# EAGLE design GSElogger (EAGLE 9.6.2)
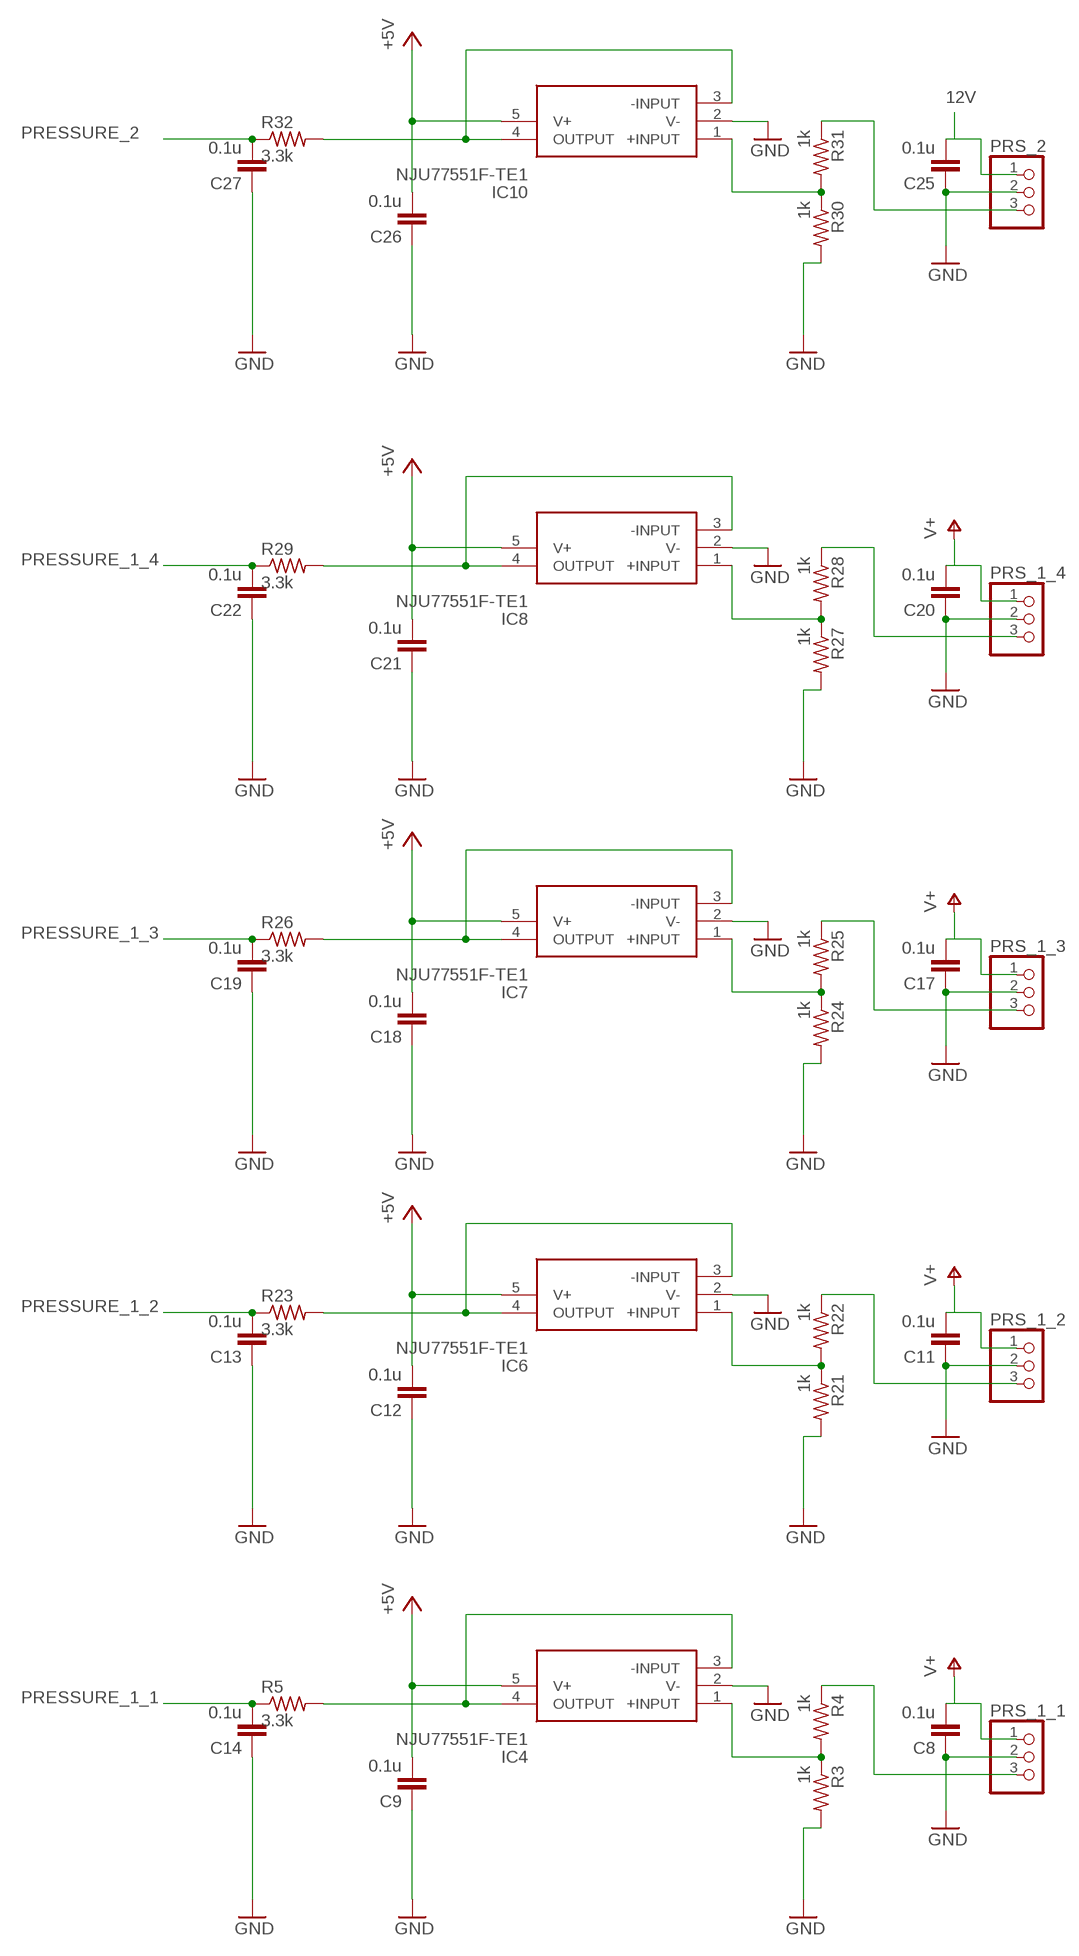
[diagram p0: schematic, sheet 1, part 1 of 3]
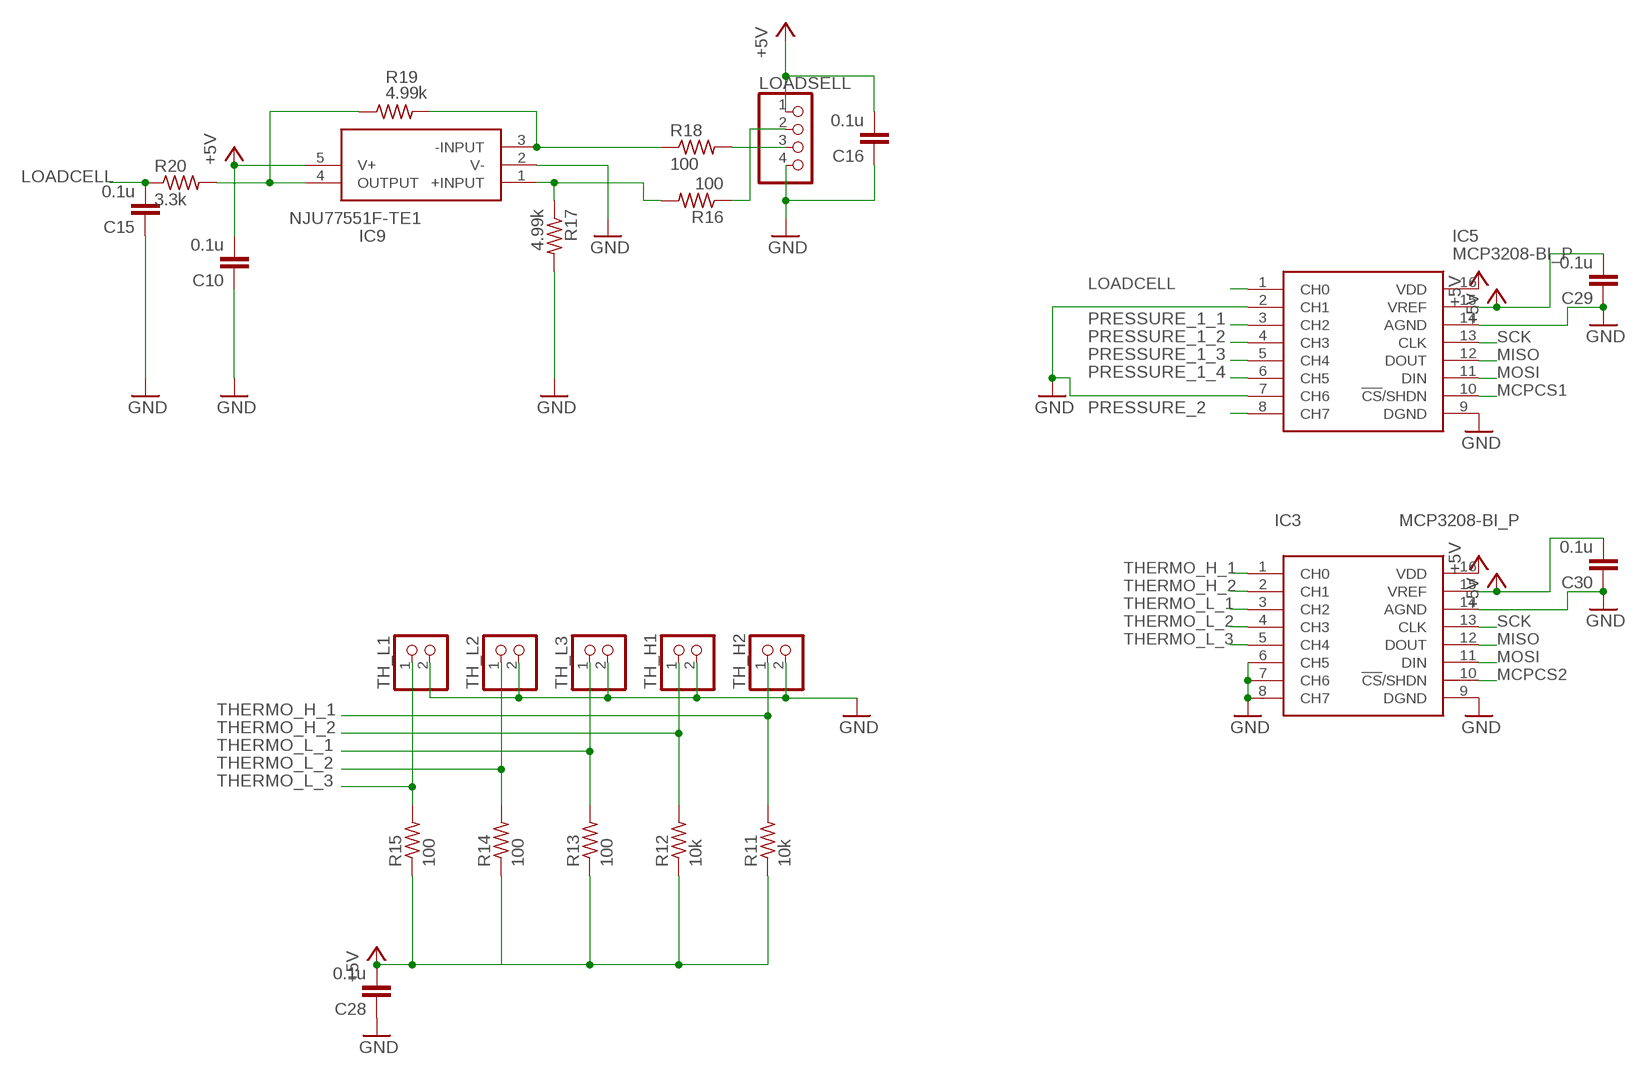
[diagram p1: schematic, sheet 1, part 2 of 3]
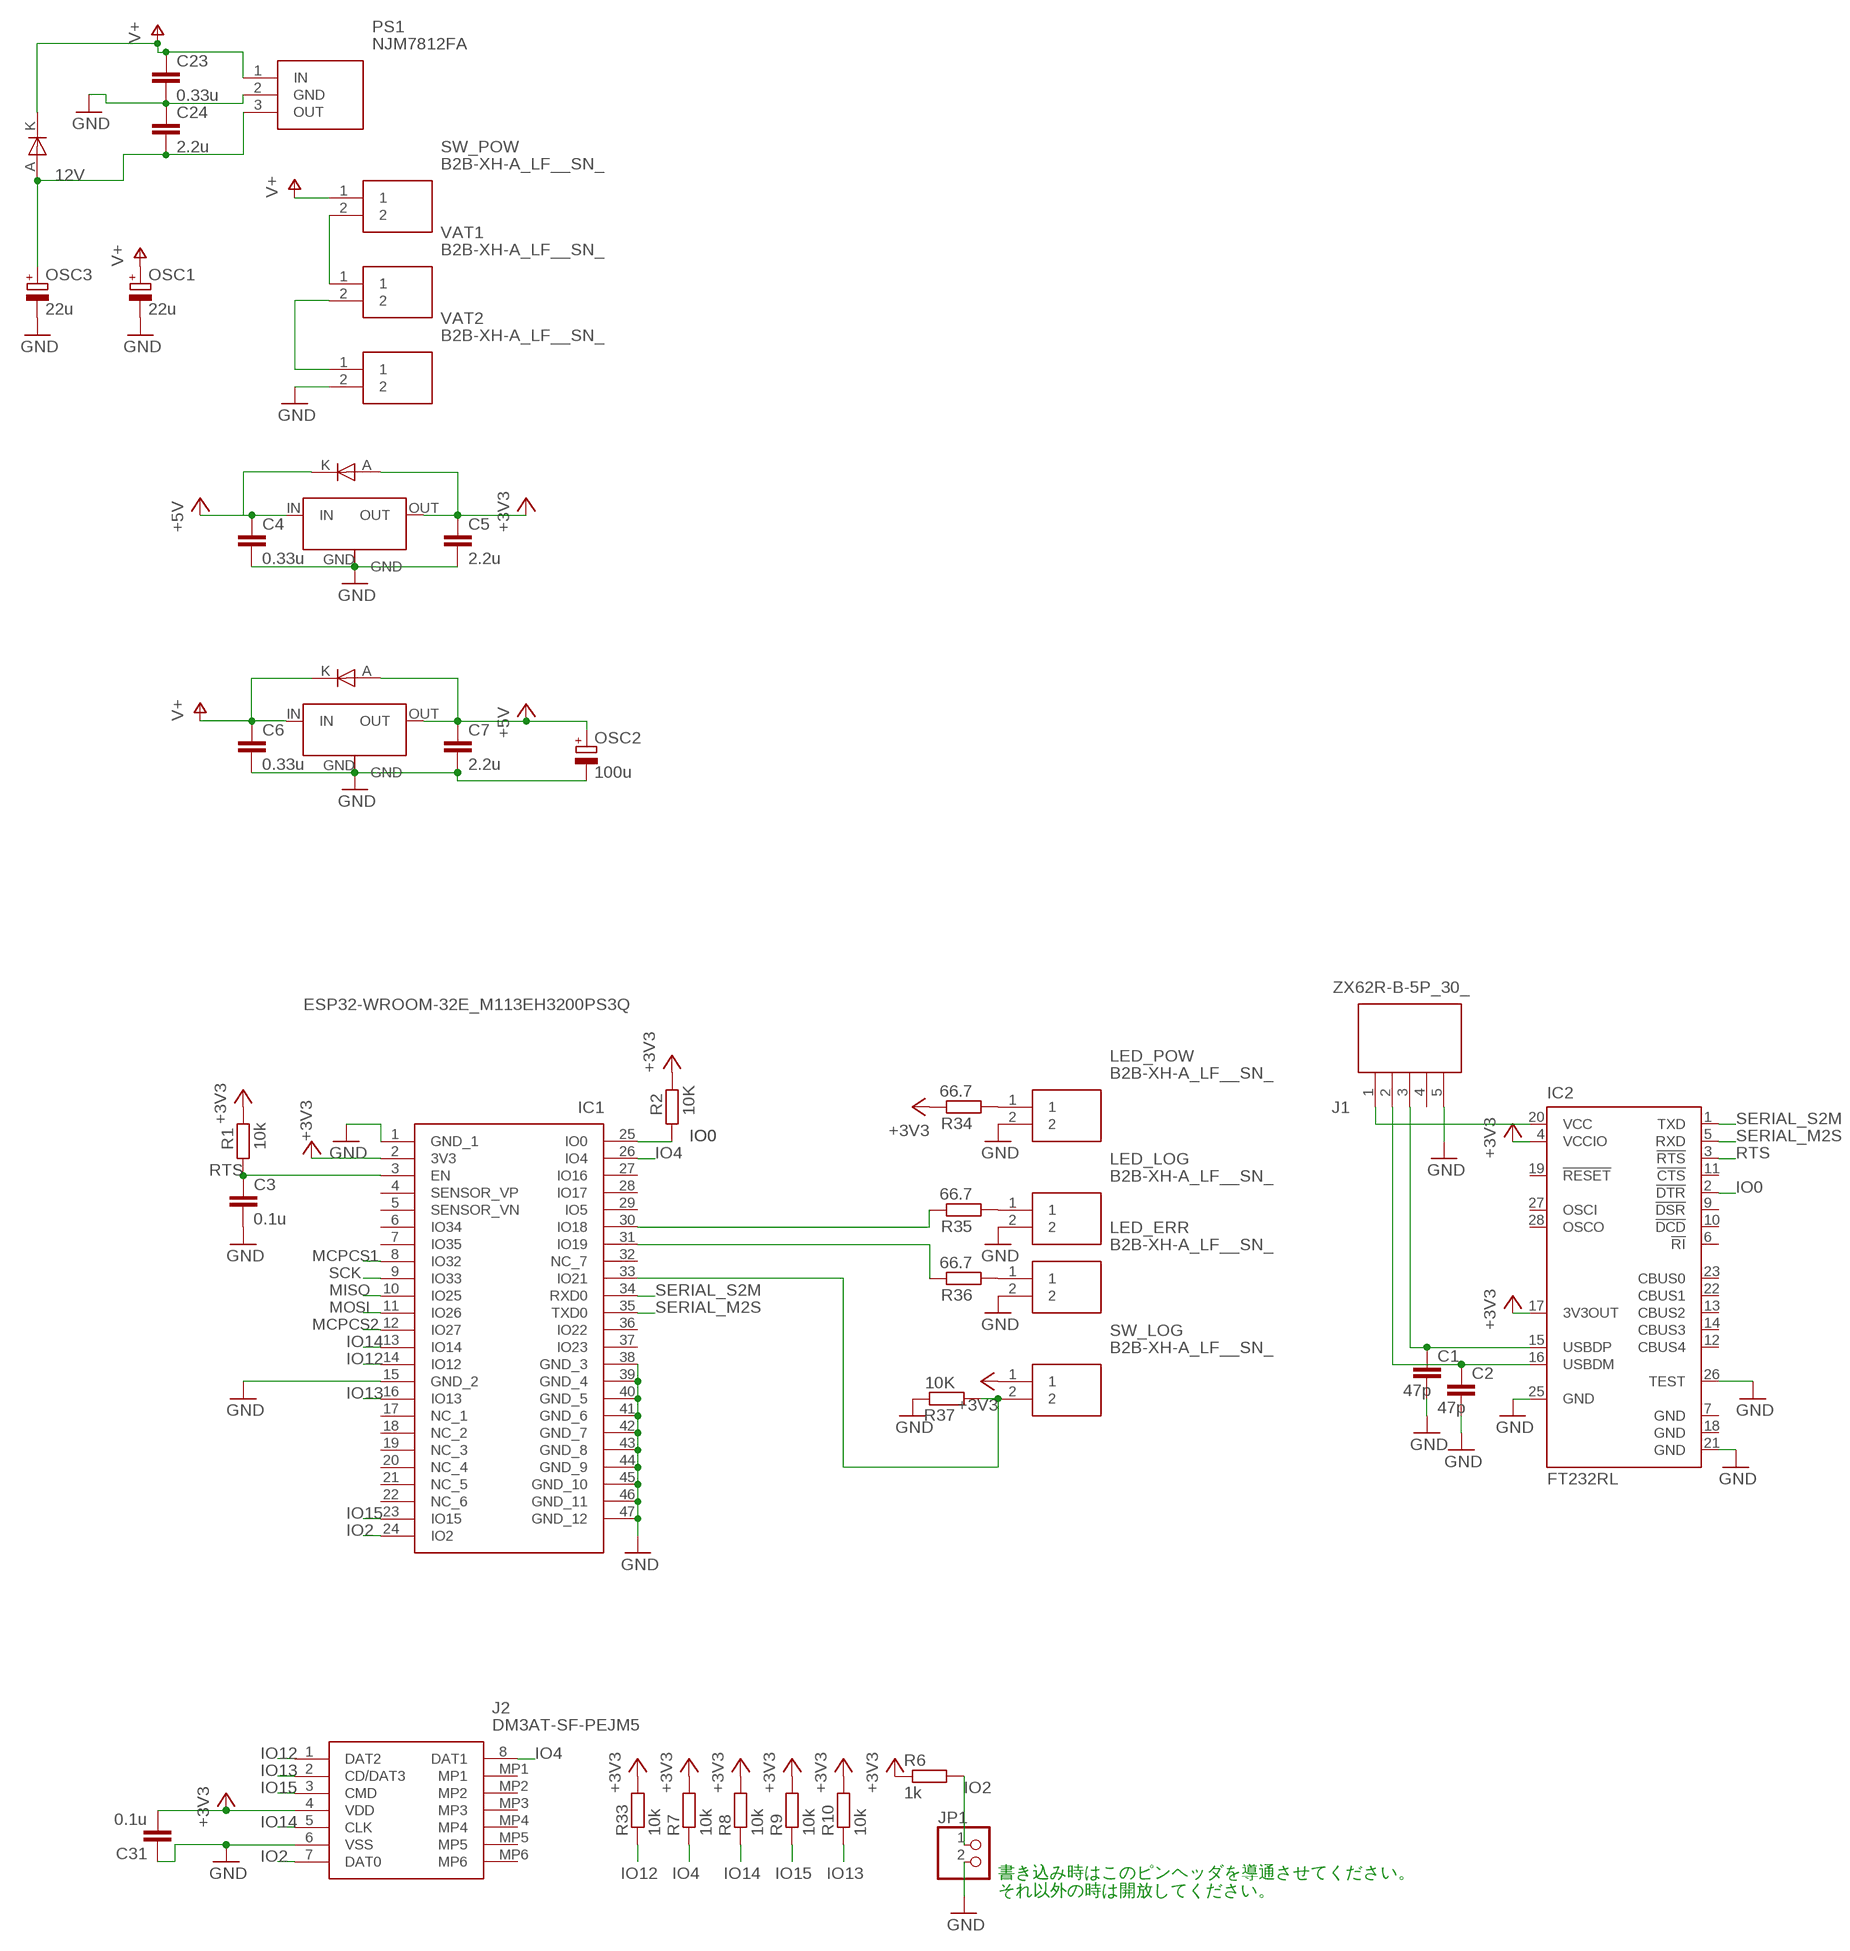
[diagram p2: schematic, sheet 1, part 3 of 3]

## Parts
C1  47p  C-EUC0603  [C0603]
C2  47p  C-EUC0603  [C0603]
C3  0.1u  C-EUC0603  [C0603]
C4  0.33u  C-EUC0603  [C0603]
C5  2.2u  C-EUC0603  [C0603]
C6  0.33u  C-EUC0603  [C0603]
C7  2.2u  C-EUC0603  [C0603]
C8  0.1u  C-EUC0603  [C0603]
C9  0.1u  C-EUC0603  [C0603]
C10  0.1u  C-EUC0603  [C0603]
C11  0.1u  C-EUC0603  [C0603]
C12  0.1u  C-EUC0603  [C0603]
C13  0.1u  C-EUC0603  [C0603]
C14  0.1u  C-EUC0603  [C0603]
C15  0.1u  C-EUC0603  [C0603]
C16  0.1u  C-EUC0603  [C0603]
C17  0.1u  C-EUC0603  [C0603]
C18  0.1u  C-EUC0603  [C0603]
C19  0.1u  C-EUC0603  [C0603]
C20  0.1u  C-EUC0603  [C0603]
C21  0.1u  C-EUC0603  [C0603]
C22  0.1u  C-EUC0603  [C0603]
C23  0.33u  C-EUC0603  [C0603]
C24  2.2u  C-EUC0603  [C0603]
C25  0.1u  C-EUC0603  [C0603]
C26  0.1u  C-EUC0603  [C0603]
C27  0.1u  C-EUC0603  [C0603]
C28  0.1u  C-EUC0603  [C0603]
C29  0.1u  C-EUC0603  [C0603]
C30  0.1u  C-EUC0603  [C0603]
C31  0.1u  C-EUC0603  [C0603]
IC1  ESP32-WROOM-32E_M113EH3200PS3Q  [ESP32WROOM32EM113EH3200PS3Q0]
IC2  FT232RL  [SSOP28]
IC3  MCP3208-BI_P  [DIP781W56P254L1918H533Q16N]
IC4  NJU77551F-TE1  [SOT95P280X130-5N]
IC5  MCP3208-BI_P  [DIP781W56P254L1918H533Q16N]
IC6  NJU77551F-TE1  [SOT95P280X130-5N]
IC7  NJU77551F-TE1  [SOT95P280X130-5N]
IC8  NJU77551F-TE1  [SOT95P280X130-5N]
IC9  NJU77551F-TE1  [SOT95P280X130-5N]
IC10  NJU77551F-TE1  [SOT95P280X130-5N]
J1  ZX62R-B-5P_30_  [ZX62R-B-5P(30)]
J2  DM3AT-SF-PEJM5  [DM3ATSFPEJM5]
JP1  PINHD-1X2  [1X02]
LED_ERR  B2B-XH-A_LF__SN_  [SHDR2W64P0X250_1X2_740X575X700]
LED_LOG  B2B-XH-A_LF__SN_  [SHDR2W64P0X250_1X2_740X575X700]
LED_POW  B2B-XH-A_LF__SN_  [SHDR2W64P0X250_1X2_740X575X700]
LOADSELL  PINHD-1X4  [1X04]
NJM7805S  5v reg  NJM2391DL1-33  [NJM2391DL1-33]
OSC1  22u  CPOL-EUE2,5-6E  [E2,5-6E]
OSC2  100u  CPOL-EUE2,5-6E  [E2,5-6E]
OSC3  22u  CPOL-EUE2,5-6E  [E2,5-6E]
PRS_1_1  PINHD-1X3  [1X03]
PRS_1_2  PINHD-1X3  [1X03]
PRS_1_3  PINHD-1X3  [1X03]
PRS_1_4  PINHD-1X3  [1X03]
PRS_2  PINHD-1X3  [1X03]
PS1  NJM7812FA  [TO254P500X1000X2170-3P]
R1  10k  R-EU_R0603  [R0603]
R2  10K  R-EU_R0603  [R0603]
R3  1k  R-US_R0603  [R0603]
R4  1k  R-US_R0603  [R0603]
R5  3.3k  R-US_R0603  [R0603]
R6  1k  R-EU_R0603  [R0603]
R7  10k  R-EU_R0603  [R0603]
R8  10k  R-EU_R0603  [R0603]
R9  10k  R-EU_R0603  [R0603]
R10  10k  R-EU_R0603  [R0603]
R11  10k  R-US_R0603  [R0603]
R12  10k  R-US_R0603  [R0603]
R13  100  R-US_R0603  [R0603]
R14  100  R-US_R0603  [R0603]
R15  100  R-US_R0603  [R0603]
R16  100  R-US_R0603  [R0603]
R17  4.99k  R-US_R0603  [R0603]
R18  100  R-US_R0603  [R0603]
R19  4.99k  R-US_R0603  [R0603]
R20  3.3k  R-US_R0603  [R0603]
R21  1k  R-US_R0603  [R0603]
R22  1k  R-US_R0603  [R0603]
R23  3.3k  R-US_R0603  [R0603]
R24  1k  R-US_R0603  [R0603]
R25  1k  R-US_R0603  [R0603]
R26  3.3k  R-US_R0603  [R0603]
R27  1k  R-US_R0603  [R0603]
R28  1k  R-US_R0603  [R0603]
R29  3.3k  R-US_R0603  [R0603]
R30  1k  R-US_R0603  [R0603]
R31  1k  R-US_R0603  [R0603]
R32  3.3k  R-US_R0603  [R0603]
R33  10k  R-EU_R0603  [R0603]
R34  66.7  R-EU_R0603  [R0603]
R35  66.7  R-EU_R0603  [R0603]
R36  66.7  R-EU_R0603  [R0603]
R37  10K  R-EU_R0603  [R0603]
SW_LOG  B2B-XH-A_LF__SN_  [SHDR2W64P0X250_1X2_740X575X700]
SW_POW  B2B-XH-A_LF__SN_  [SHDR2W64P0X250_1X2_740X575X700]
TH_H1  PINHD-1X2  [1X02]
TH_H2  PINHD-1X2  [1X02]
TH_L1  PINHD-1X2  [1X02]
TH_L2  PINHD-1X2  [1X02]
TH_L3  PINHD-1X2  [1X02]
U$1  SS2040FL  [SS2040FL]
U$2  3v3 reg  NJM2391DL1-33  [NJM2391DL1-33]
U$3  SS2040FL  [SS2040FL]
U$4  SS2040FL  [SS2040FL]
VAT1  B2B-XH-A_LF__SN_  [SHDR2W64P0X250_1X2_740X575X700]
VAT2  B2B-XH-A_LF__SN_  [SHDR2W64P0X250_1X2_740X575X700]

## Nets
12V: C24.2 C25.2 OSC3.+ PRS_2.1 PS1.3(OUT) U$4.A
+3V3: C5.1 C31.2 IC1.2(3V3) IC2.4(VCCIO) IC2.17(3V3OUT) J2.4(VDD) R1.2 R2.2 R6.1 R7.2 R8.2 R9.2 R10.2 R33.2 R34.2 SW_LOG.1 U$1.A U$2.OUT
+5V: C4.1 C7.1 C9.2 C10.2 C12.2 C16.2 C18.2 C21.2 C26.2 C28.2 C29.2 C30.2 IC3.15(VREF) IC3.16(VDD) IC4.5(V+) IC5.15(VREF) IC5.16(VDD) IC6.5(V+) IC7.5(V+) IC8.5(V+) IC9.5(V+) IC10.5(V+) LOADSELL.1 NJM7805S.OUT OSC2.+ R11.1 R12.1 R13.1 R14.1 R15.1 U$1.K U$2.IN U$3.A
GND: C1.2 C2.2 C3.2 C4.2 C5.2 C6.2 C7.2 C8.1 C9.1 C10.1 C11.1 C12.1 C13.1 C14.1 C15.1 C16.1 C17.1 C18.1 C19.1 C20.1 C21.1 C22.1 C23.2 C24.1 C25.1 C26.1 C27.1 C28.1 C29.1 C30.1 C31.1 IC1.1(GND_1) IC1.15(GND_2) IC1.38(GND_3) IC1.39(GND_4) IC1.40(GND_5) IC1.41(GND_6) IC1.42(GND_7) IC1.43(GND_8) IC1.44(GND_9) IC1.45(GND_10) IC1.46(GND_11) IC1.47(GND_12) IC2.21(GND) IC2.25(GND) IC2.26(TEST) IC3.6(CH5) IC3.7(CH6) IC3.8(CH7) IC3.9(DGND) IC3.14(AGND) IC4.2(V-) IC5.2(CH1) IC5.7(CH6) IC5.9(DGND) IC5.14(AGND) IC6.2(V-) IC7.2(V-) IC8.2(V-) IC9.2(V-) IC10.2(V-) J1.5 J2.6(VSS) JP1.2 LED_ERR.2 LED_LOG.2 LED_POW.2 LOADSELL.4 NJM7805S.GND OSC1.- OSC2.- OSC3.- PRS_1_1.2 PRS_1_2.2 PRS_1_3.2 PRS_1_4.2 PRS_2.2 PS1.2(GND) R3.2 R17.2 R21.2 R24.2 R27.2 R30.2 R37.2 TH_H1.2 TH_H2.2 TH_L1.2 TH_L2.2 TH_L3.2 U$2.GND VAT2.2
IO0: IC1.25(IO0) IC2.2(!DTR) R2.1
IO2: IC1.24(IO2) J2.7(DAT0) JP1.1 R6.2
IO4: IC1.26(IO4) J2.8(DAT1) R7.1
IO12: IC1.14(IO12) J2.1(DAT2) R33.1
IO13: IC1.16(IO13) J2.2(CD/DAT3) R10.1
IO14: IC1.13(IO14) J2.5(CLK) R8.1
IO15: IC1.23(IO15) J2.3(CMD) R9.1
LOADCELL: C15.2 IC5.1(CH0) R20.1
MCPCS1: IC1.8(IO32) IC5.10(!CS!/SHDN)
MCPCS2: IC1.12(IO27) IC3.10(!CS!/SHDN)
MISO: IC1.10(IO25) IC3.12(DOUT) IC5.12(DOUT)
MOSI: IC1.11(IO26) IC3.11(DIN) IC5.11(DIN)
N$1: IC4.3(-INPUT) IC4.4(OUTPUT) R5.2
N$2: IC2.20(VCC) J1.1
N$3: C2.1 IC2.16(USBDM) J1.2
N$4: C1.1 IC2.15(USBDP) J1.3
N$5: IC4.1(+INPUT) R3.1 R4.2
N$6: IC6.1(+INPUT) R21.1 R22.2
N$7: PRS_1_1.3 R4.1
N$8: PRS_1_2.3 R22.1
N$9: IC6.3(-INPUT) IC6.4(OUTPUT) R23.2
N$10: IC7.1(+INPUT) R24.1 R25.2
N$11: PRS_1_3.3 R25.1
N$12: IC7.3(-INPUT) IC7.4(OUTPUT) R26.2
N$13: IC8.1(+INPUT) R27.1 R28.2
N$14: PRS_1_4.3 R28.1
N$15: IC8.3(-INPUT) IC8.4(OUTPUT) R29.2
N$16: IC9.4(OUTPUT) R19.1 R20.2
N$17: VAT1.2 VAT2.1
N$18: IC10.1(+INPUT) R30.1 R31.2
N$19: PRS_2.3 R31.1
N$20: IC10.3(-INPUT) IC10.4(OUTPUT) R32.2
N$21: SW_POW.2 VAT1.1
N$22: LOADSELL.2 R16.1
N$23: LED_POW.1 R34.1
N$24: IC9.3(-INPUT) R18.1 R19.2
N$25: LOADSELL.3 R18.2
N$26: LED_LOG.1 R35.1
N$27: LED_ERR.1 R36.1
N$28: IC9.1(+INPUT) R16.2 R17.1
N$29: IC1.30(IO18) R35.2
N$30: IC1.31(IO19) R36.2
N$31: IC1.33(IO21) R37.1 SW_LOG.2
PRESSURE_1_1: C14.2 IC5.3(CH2) R5.1
PRESSURE_1_2: C13.2 IC5.4(CH3) R23.1
PRESSURE_1_3: C19.2 IC5.5(CH4) R26.1
PRESSURE_1_4: C22.2 IC5.6(CH5) R29.1
PRESSURE_2: C27.2 IC5.8(CH7) R32.1
RTS: C3.1 IC1.3(EN) IC2.3(!RTS) R1.1
SCK: IC1.9(IO33) IC3.13(CLK) IC5.13(CLK)
SERIAL_M2S: IC1.35(TXD0) IC2.5(RXD)
SERIAL_S2M: IC1.34(RXD0) IC2.1(TXD)
THERMO_H_1: IC3.1(CH0) R11.2 TH_H2.1
THERMO_H_2: IC3.2(CH1) R12.2 TH_H1.1
THERMO_L_1: IC3.3(CH2) R13.2 TH_L3.1
THERMO_L_2: IC3.4(CH3) R14.2 TH_L2.1
THERMO_L_3: IC3.5(CH4) R15.2 TH_L1.1
V+: C6.1 C8.2 C11.2 C17.2 C20.2 C23.1 NJM7805S.IN OSC1.+ PRS_1_1.1 PRS_1_2.1 PRS_1_3.1 PRS_1_4.1 PS1.1(IN) SW_POW.1 U$3.K U$4.K
Unconnected: IC1.4(SENSOR_VP) IC1.5(SENSOR_VN) IC1.6(IO34) IC1.7(IO35) IC1.17(NC_1) IC1.18(NC_2) IC1.19(NC_3) IC1.20(NC_4) IC1.21(NC_5) IC1.22(NC_6) IC1.27(IO16) IC1.28(IO17) IC1.29(IO5) IC1.32(NC_7) IC1.36(IO22) IC1.37(IO23) IC2.6(!RI) IC2.9(!DSR) IC2.10(!DCD) IC2.11(!CTS) IC2.12(CBUS4) IC2.13(CBUS2) IC2.14(CBUS3) IC2.19(!RESET) IC2.22(CBUS1) IC2.23(CBUS0) IC2.27(OSCI) IC2.28(OSCO) J1.4 J2.MP1 J2.MP2 J2.MP3 J2.MP4 J2.MP5 J2.MP6

## Notes on the sheet
- 書き込み時はこのピンヘッダを導通させてください。
  それ以外の時は開放してください。

## Power pins joined to a net without a drawn wire
GND: IC2.7(GND) IC2.18(GND)

## Library data of the parts
C1-C31 = rcl:C-EU: CAPACITOR, European symbol; SPICEPREFIX: C
IC1 = SamacSys_Parts:ESP32-WROOM-32E_M113EH3200PS3Q: WiFi Modules (802.11) SMD module, ESP32-D0WD-V3, ESP32 ECO V3, 4 MB SPI flash, PCB antenna, -40 C ~ +105 C. Source: Datasheet <https://www.espressif.com/sites/default/files/documentation/esp32-wroom-32e_esp32-wroom-32ue_datasheet_en.pdf>; DESCRIPTION: WiFi Modules (802.11) SMD module, ESP32-D0WD-V3, ESP32 ECO V3, 4 MB SPI flash, PCB antenna, -40 C ~ +105 C.; HEIGHT: 3.25mm; MANUFACTURER_NAME: Espressif Systems; MANUFACTURER_PART_NUMBER: ESP32-WROOM-32E(M113EH3200PS3Q0); MOUSER_PART_NUMBER: 356-ESP32WRM320EH3PS; MOUSER_PRICE-STOCK: https://www.mouser.co.uk/ProductDetail/Espressif-Systems/ESP32-WROOM-32EM113EH3200PS3Q0?qs=sPbYRqrBIVkiZhzSFda8%2FA%3D%3D
IC2 = ftdichip:FT232R: Source: http://www.ftdichip.com/Documents/DataSheets/DS_FT232R_v104.pdf; MPN: FT232RL; OC_FARNELL: 1146032; OC_NEWARK: 91K9918
IC3 IC5 = SamacSys_Parts:MCP3208-BI_P: 12 bit ADC Differential, Serial, 16-Pin PDIP Source: Datasheet <https://datasheet.datasheetarchive.com/originals/distributors/Datasheets-DGA17/1031129.pdf>; ARROW_PART_NUMBER: MCP3208-BI/P; ARROW_PRICE-STOCK: https://www.arrow.com/en/products/mcp3208-bip/microchip-technology?region=nac; DESCRIPTION: 12 bit ADC Differential, Serial, 16-Pin PDIP; HEIGHT: 5.334mm; MANUFACTURER_NAME: Microchip; MANUFACTURER_PART_NUMBER: MCP3208-BI/P; MOUSER_PART_NUMBER: 579-MCP3208-BI/P; MOUSER_PRICE-STOCK: https://www.mouser.co.uk/ProductDetail/Microchip-Technology/MCP3208-BI-P?qs=iwvYsH9bSFbUibDxw9o3cw%3D%3D
IC4 IC6-IC10 = SamacSys_Parts:NJU77551F-TE1: IC OPAMP GP 1 CIRCUIT SOT23-5 Source: Datasheet <https://www.mouser.in/datasheet/2/294/NJU77550_NJU77551_NJU77552_NJU77554_E-1371145.pdf>; DESCRIPTION: IC OPAMP GP 1 CIRCUIT SOT23-5; HEIGHT: 1.3mm; MANUFACTURER_NAME: New Japan Radio; MANUFACTURER_PART_NUMBER: NJU77551F-TE1; MOUSER_PART_NUMBER: 513-NJU77551F-TE1; MOUSER_PRICE-STOCK: https://www.mouser.co.uk/ProductDetail/NJR/NJU77551F-TE1?qs=%252B6g0mu59x7K%2FR%252BJlv4Vu3w%3D%3D
J1 = SamacSys_Parts:ZX62R-B-5P_30_: Hirose ZX, Straight SMT, Type B Version 2.0 Micro USB Connector Receptacle Source: Datasheet <http://www.farnell.com/datasheets/2360818.pdf>; ARROW_PART_NUMBER: ZX62R-B-5P(30); ARROW_PRICE-STOCK: https://www.arrow.com/en/products/zx62r-b-5p-30/hirose-electric; DESCRIPTION: Hirose ZX, Straight SMT, Type B Version 2.0 Micro USB Connector Receptacle; HEIGHT: mm; MANUFACTURER_NAME: Hirose; MANUFACTURER_PART_NUMBER: ZX62R-B-5P(30); MOUSER_PART_NUMBER: 798-ZX62R-B-5P30; MOUSER_PRICE-STOCK: https://www.mouser.co.uk/ProductDetail/Hirose-Connector/ZX62R-B-5P30?qs=4J5DPWWS9EAThzyZtJ4A7A%3D%3D
J2 = SamacSys_Parts:DM3AT-SF-PEJM5: Memory Card Connectors R/A SMT MICROSD CON PUSH-PUSH TOP BRDMNT Source: Datasheet <https://datasheet.lcsc.com/szlcsc/Hirose-HRS-DM3AT-SF-PEJM5_C114218.pdf>; DESCRIPTION: Memory Card Connectors R/A SMT MICROSD CON PUSH-PUSH TOP BRDMNT; HEIGHT: 1.83mm; MANUFACTURER_NAME: Hirose; MANUFACTURER_PART_NUMBER: DM3AT-SF-PEJM5; MOUSER_PART_NUMBER: 798-DM3AT-SF-PEJM5; MOUSER_PRICE-STOCK: https://www.mouser.co.uk/ProductDetail/Hirose-Connector/DM3AT-SF-PEJM5?qs=LZSZKJVF%252B2WTDKp%252BR7IYAQ%3D%3D
JP1 TH_H1 TH_H2 TH_L1-TH_L3 = pinhead:PINHD-1X2: PIN HEADER
LED_ERR LED_LOG LED_POW SW_LOG SW_POW VAT1 VAT2 = SamacSys_Parts:B2B-XH-A_LF__SN_: Connector Header Through Hole 2 position 0.098" (2.50mm) Source: Datasheet <http://www.jst-mfg.com/product/pdf/eng/eXH.pdf>; ARROW_PART_NUMBER: B2B-XH-A(LF)(SN); ARROW_PRICE-STOCK: https://www.arrow.com/en/products/b2b-xh-a-lf-sn/jst-manufacturing?region=europe; DESCRIPTION: Connector Header Through Hole 2 position 0.098" (2.50mm); HEIGHT: 7mm; MANUFACTURER_NAME: JST (JAPAN SOLDERLESS TERMINALS); MANUFACTURER_PART_NUMBER: B2B-XH-A(LF)(SN)
LOADSELL = pinhead:PINHD-1X4: PIN HEADER
NJM7805S U$2 = CREATE_sensor_dip:NJM2391DL1-33
OSC1-OSC3 = rcl:CPOL-EU: POLARIZED CAPACITOR, European symbol; SPICEPREFIX: C
PRS_1_1-PRS_1_4 PRS_2 = pinhead:PINHD-1X3: PIN HEADER
PS1 = SamacSys_Parts:NJM7812FA: Linear Voltage Regulators 12V 1.5A 3 Terminal Source: Datasheet <https://componentsearchengine.com/Datasheets/1/NJM7812FA.pdf>; DESCRIPTION: Linear Voltage Regulators 12V 1.5A 3 Terminal; HEIGHT: 5mm; MANUFACTURER_NAME: New Japan Radio; MANUFACTURER_PART_NUMBER: NJM7812FA; MOUSER_PART_NUMBER: 513-NJM7812FA; MOUSER_PRICE-STOCK: https://www.mouser.co.uk/ProductDetail/NJR/NJM7812FA?qs=zkD0Fgr6F%252BmtJvTrEE%2FNvg%3D%3D
R1 R2 R6-R10 R33-R37 = rcl:R-EU_: RESISTOR, European symbol; SPICEPREFIX: R
R3-R5 R11-R32 = rcl:R-US_: RESISTOR, American symbol; SPICEPREFIX: R
U$1 U$3 U$4 = CREATE_sensor_dip:SS2040FL

## Board
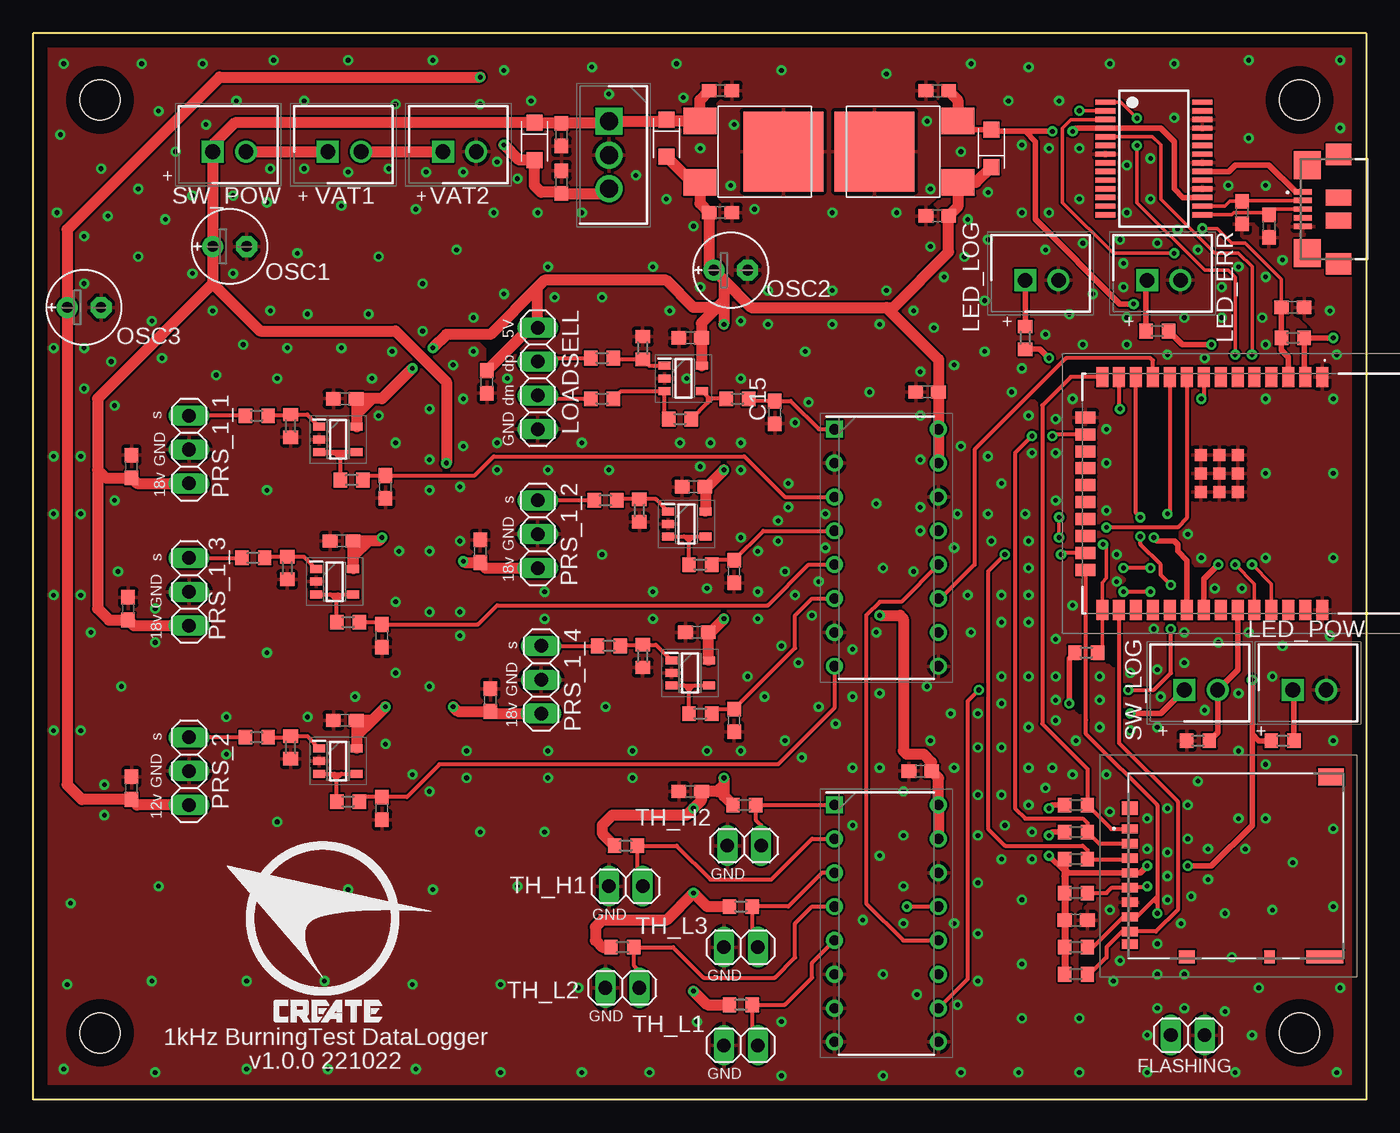
[diagram p3: board, top side]
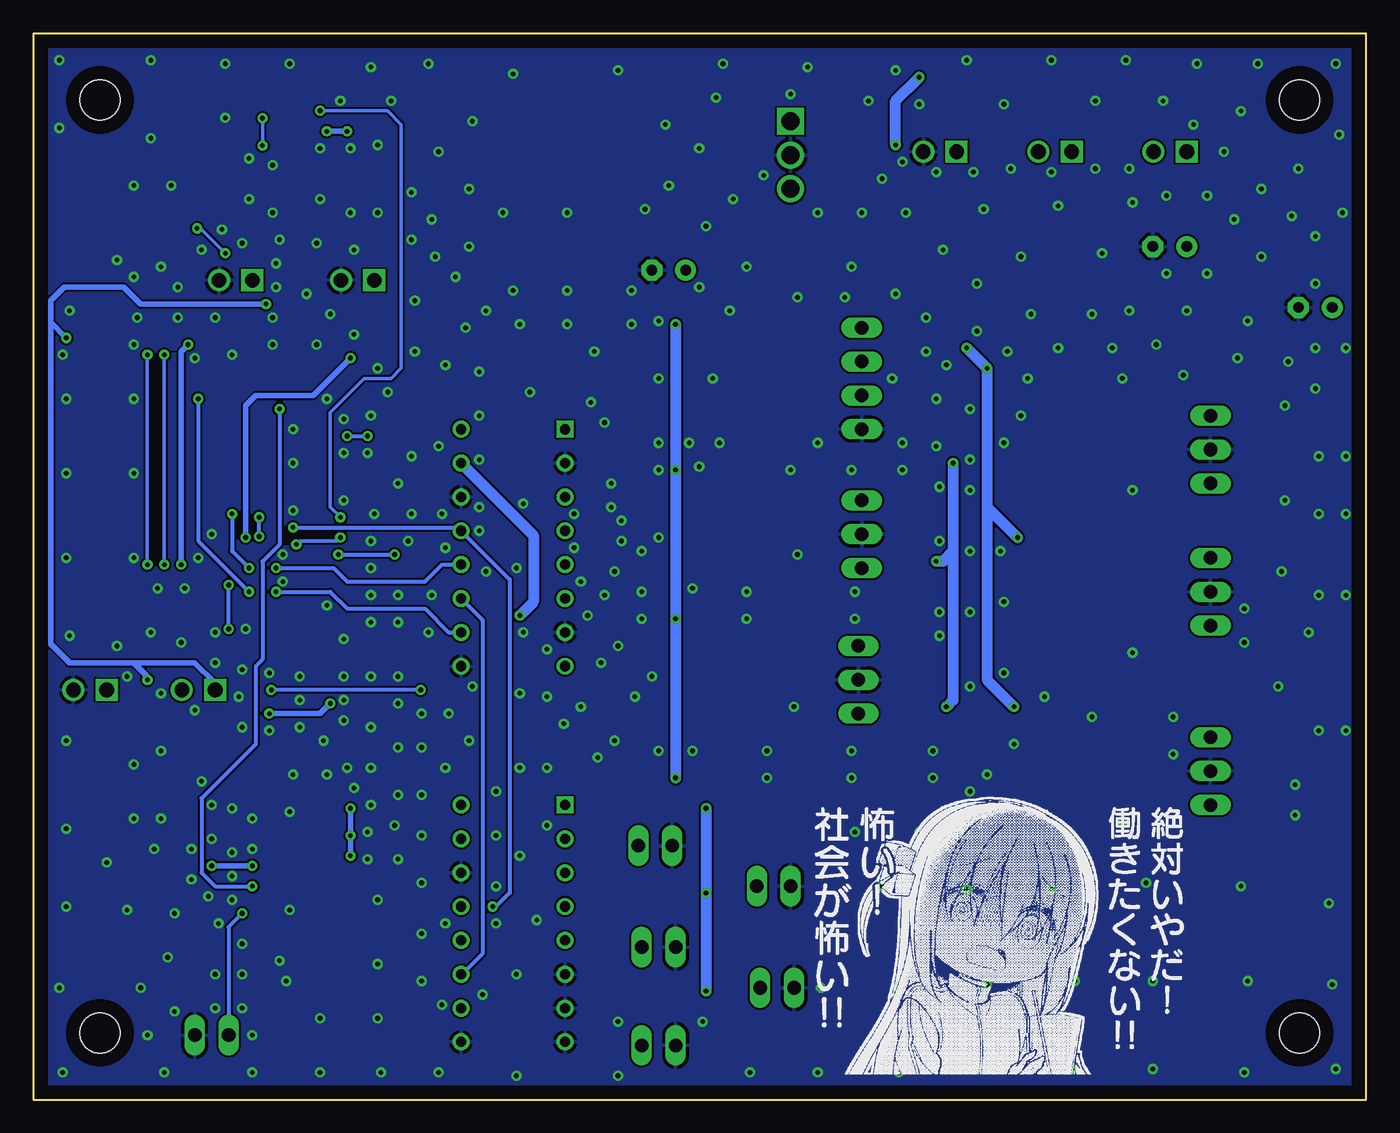
[diagram p4: board, bottom side, seen from below]

Size 100 x 80 mm. Coordinates in mm from the lower left corner, seen from the top.
Outline: 0,0 0,80 100,80 100,0 0,0
Copper layers (1*16): Top 0.035mm / dielectric 1.5mm / Bottom 0.035mm
Design rules "default": minimum track width 6mil, minimum drill 0.35mm, track to track 6mil, track to pad 6mil, pad to pad 6mil, via to via 6mil, smd to smd 6mil, copper to edge 40mil, drill to drill 6mil, minimum pad ring 10mil, minimum via ring 8mil, stop-mask expansion 4mil, vias tented up to drill 0mil, thermal gap 10mil
Holes 3 mm at 5,5 95,5 95,75 5,75
tRestrict: 31 lines
bRestrict: 3 lines

### Footprints (pad centres in the part's own frame; a part is rotated, then mirrored left to right if it is on the bottom)
C0603 = smd 1.1 x 1: 1 -0.85,0; 2 0.85,0
ESP32WROOM32EM113EH3200PS3Q0 = smd 1.5 x 0.9: 1 -8.75,5.26; 2 -8.75,3.99; 3 -8.75,2.72; 4 -8.75,1.45; 5 -8.75,0.18; 6 -8.75,-1.09; 7 -8.75,-2.36; 8 -8.75,-3.63; 9 -8.75,-4.9; 10 -8.75,-6.17; 11 -8.75,-7.44; 12 -8.75,-8.71; 13 -8.75,-9.98; 14 -8.75,-11.25; 25 8.75,-11.25; 26 8.75,-9.98; 27 8.75,-8.71; 28 8.75,-7.44; 29 8.75,-6.17; 30 8.75,-4.9; 31 8.75,-3.63; 32 8.75,-2.36; 33 8.75,-1.09; 34 8.75,0.18; 35 8.75,1.45; 36 8.75,2.72; 37 8.75,3.99; 38 8.75,5.26 | smd 0.9 x 1.5: 15 -5.71,-12.5; 16 -4.44,-12.5; 17 -3.17,-12.5; 18 -1.9,-12.5; 19 -0.63,-12.5; 20 0.64,-12.5; 21 1.91,-12.5; 22 3.18,-12.5; 23 4.45,-12.5; 24 5.72,-12.5 | smd 0.9 x 0.9: 39 -1.5,-2.46; 40 -1.5,-3.86; 41 -0.1,-3.86; 42 -0.1,-2.46; 43 -0.1,-1.06; 44 -1.5,-1.06; 45 -2.9,-1.06; 46 -2.9,-2.46; 47 -2.9,-3.86
SSOP28 = smd 0.4 x 1.5: 1 -4.225,-3.625; 2 -3.575,-3.625; 3 -2.925,-3.625; 4 -2.275,-3.625; 5 -1.625,-3.625; 6 -0.975,-3.625; 7 -0.325,-3.625; 8 0.325,-3.625; 9 0.975,-3.625; 10 1.625,-3.625; 11 2.275,-3.625; 12 2.925,-3.625; 13 3.575,-3.625; 14 4.225,-3.625; 15 4.225,3.625; 16 3.575,3.625; 17 2.925,3.625; 18 2.275,3.625; 19 1.625,3.625; 20 0.975,3.625; 21 0.325,3.625; 22 -0.325,3.625; 23 -0.975,3.625; 24 -1.625,3.625; 25 -2.275,3.625; 26 -2.925,3.625; 27 -3.575,3.625; 28 -4.225,3.625
DIP781W56P254L1918H533Q16N = drill 0.759 pad 1.159 square: 1 -3.905,8.89 | drill 0.759 pad 1.159: 2 -3.905,6.35; 3 -3.905,3.81; 4 -3.905,1.27; 5 -3.905,-1.27; 6 -3.905,-3.81; 7 -3.905,-6.35; 8 -3.905,-8.89; 9 3.905,-8.89; 10 3.905,-6.35; 11 3.905,-3.81; 12 3.905,-1.27; 13 3.905,1.27; 14 3.905,3.81; 15 3.905,6.35; 16 3.905,8.89
SOT95P280X130-5N = smd 0.9 x 0.6: 1 -1.4,0.95; 2 -1.4,0; 3 -1.4,-0.95; 4 1.4,-0.95; 5 1.4,0.95
ZX62R-B-5P(30) = smd 0.4 x 1.35: 1 1.3,4.825; 2 0.65,4.825; 3 0,4.825; 4 -0.65,4.825; 5 -1.3,4.825 | smd 2.1 x 2: 6 -3.3,4.5; 7 3.3,4.5 | smd 1.6 x 1.9: 8 -4.1,2.15; 9 4.1,2.15 | smd 1.2 x 1.9: 10 -0.85,2.15; 11 0.85,2.15
DM3ATSFPEJM5 = smd 0.7 x 1.2: 1 2.775,7.412; 2 1.675,7.412; 3 0.575,7.412; 4 -0.525,7.412; 5 -1.625,7.412; 6 -2.725,7.412; 7 -3.825,7.412; 8 -4.925,7.412; MP2 -5.875,7.412 | smd 1 x 1.2: MP1 4.325,7.412; MP3 -6.825,3.112 | smd 1 x 0.8: MP4 -6.825,-3.087 | smd 1 x 2.8: MP5 -6.825,-7.237 | smd 1.3 x 1.9: MP6 6.675,-7.688
1X02 = drill 1.016 long: 1 -1.27,0; 2 1.27,0
SHDR2W64P0X250_1X2_740X575X700 = drill 1.1 pad 1.65 square: 1 0,0 | drill 1.1 pad 1.65: 2 2.5,0
1X04 = drill 1.016 long: 1 -3.81,0; 2 -1.27,0; 3 1.27,0; 4 3.81,0
NJM2391DL1-33 = smd 6 x 6: GND 0,1.4 | smd 2 x 2.5: IN -2.3,-4.85; OUT 2.3,-4.85
E2,5-6E = drill 0.813 pad 1.575: + -1.27,0 | drill 0.813 pad 1.575 octagon: - 1.27,0
1X03 = drill 1.016 long: 1 -2.54,0; 2 0,0; 3 2.54,0
TO254P500X1000X2170-3P = drill 1.35 pad 2.025 square: 1 0,0 | drill 1.35 pad 2.025: 2 2.54,0; 3 5.08,0
R0603 = smd 1 x 1.1: 1 -0.85,0; 2 0.85,0
SS2040FL = smd 1.2 x 1.2: A 1.4,0; K -1.4,0

### Placement (x,y rotation side)
C1  92.71,65.53 270 top
C2  90.68,66.55 270 top
C3  94.49,59.44 0 top
C4  67.82,66.29 180 top
C5  67.82,75.69 180 top
C6  51.56,75.69 0 top
C7  51.56,66.55 0 top
C8  7.37,47.5 270 top
C9  23.37,52.58 0 top
C10  49.28,57.15 0 top
C11  33.53,41.15 270 top
C12  49.53,45.97 0 top
C13  52.58,39.62 90 top
C14  26.42,45.97 90 top
C15  55.63,51.56 90 top
C16  34.04,53.85 90 top
C17  7.11,36.83 270 top
C18  23.11,41.91 0 top
C19  26.16,34.8 90 top
C20  34.29,29.97 270 top
C21  49.78,35.05 0 top
C22  52.58,28.45 90 top
C23  39.62,72.39 270 top
C24  39.62,68.83 270 top
C25  7.37,23.37 270 top
C26  23.37,28.45 0 top
C27  26.16,21.84 90 top
C28  49.28,23.11 0 top
C29  67.06,53.09 0 top
C30  66.55,24.64 0 top
C31  78.23,13.46 180 top
IC1  91.44,45.47 270 top
IC2  84.07,70.61 270 top
IC3  64.01,13.21 0 top
IC4  22.86,49.53 0 top
IC5  64.01,41.4 0 top
IC6  49.02,43.18 0 top
IC7  22.61,38.86 0 top
IC8  49.28,32 0 top
IC9  48.77,54.1 0 top
IC10  22.86,25.4 0 top
J1  100.08,66.8 90 top
J2  89.66,17.53 90 top
JP1  86.61,4.83 0 top
LED_ERR  83.57,61.47 0 top
LED_LOG  74.42,61.47 0 top
LED_POW  94.49,30.73 0 top
LOADSELL  37.85,54.1 270 top
NJM7805S  54.86,71.12 270 top
OSC1  14.73,64.01 0 top
OSC2  52.32,62.23 0 top
OSC3  3.81,59.44 0 top
PRS_1_1  11.68,48.77 90 top
PRS_1_2  37.85,42.42 90 top
PRS_1_3  11.68,38.1 90 top
PRS_1_4  38.1,31.5 90 top
PRS_2  11.68,24.64 90 top
PS1  43.18,73.41 270 top
R1  94.49,57.15 0 top
R2  78.99,33.53 180 top
R3  19.3,50.55 270 top
R4  16.76,51.31 0 top
R5  23.88,46.48 180 top
R6  78.23,11.43 0 top
R7  78.23,9.4 180 top
R8  78.23,15.49 180 top
R9  78.23,18.03 180 top
R10  78.23,20.07 180 top
R11  53.34,22.1 0 top
R12  44.45,19.05 0 top
R13  53.09,14.48 0 top
R14  44.2,11.43 0 top
R15  53.09,7.11 0 top
R16  42.67,55.63 0 top
R17  45.72,56.39 90 top
R18  42.67,52.58 180 top
R19  48.51,51.05 180 top
R20  52.83,52.58 180 top
R21  45.47,44.2 270 top
R22  42.93,44.96 0 top
R23  50.04,40.13 180 top
R24  19.05,39.88 270 top
R25  16.51,40.64 0 top
R26  23.62,35.81 180 top
R27  45.72,33.27 270 top
R28  43.18,34.04 0 top
R29  50.04,28.96 180 top
R30  19.3,26.42 270 top
R31  16.76,27.18 0 top
R32  23.62,22.35 180 top
R33  78.23,22.1 180 top
R34  93.73,26.92 180 top
R35  74.42,57.15 270 top
R36  84.33,57.66 0 top
R37  87.38,26.92 180 top
SW_LOG  86.36,30.73 0 top
SW_POW  13.46,71.12 0 top
TH_H1  44.45,16 180 top
TH_H2  53.34,19.05 180 top
TH_L1  53.09,4.06 180 top
TH_L2  44.2,8.38 180 top
TH_L3  53.09,11.43 180 top
U$1  71.88,71.37 90 top
U$2  64.52,71.12 90 top
U$3  47.5,72.14 270 top
U$4  37.59,71.88 270 top
VAT1  22.1,71.12 0 top
VAT2  30.73,71.12 0 top

### Tracks (layer width: path | path; a pad name or v marks a point on that pad's centre or on a via)
12V  (via drill 0.35)
  Top 0.813: PS1.3 42.84,67.98 C24.2 39.54,68.07 38.1,68.07 37.59,68.58 U$4.A 36.45,70.48 v35.31,71.63 | PRS_2.1 7.79,22.1 C25.2 3.64,22.52 2.54,23.62 OSC3.+ 2.54,65.28 13.97,76.71 v33.53,76.71
  Bottom 0.813: v35.31,71.63 35.31,74.93 v33.53,76.71
+3V3  (via drill 0.35)
  Top 0.406: IC2.17 86.24,67.69 85.6,68.33 85.6,71.88 84.58,72.9 82.04,72.9 82.03,72.89 IC2.4 78.22,72.89 v77.98,72.64 | 70.14,72.64 U$2.OUT 70.01,72.77 U$1.A 72.01,72.64 74.42,72.64 | 74.42,72.64 v76.45,72.64 | 74.42,72.64 75.18,71.88 75.18,66.04 81.53,59.69 v82.55,59.69 | v97.54,57.15 R1.2 95.34,54.31 IC1.2 | v91.44,31.5 91.44,27.43 | 91.44,27.43 91.95,26.92 R34.2 | 91.44,27.43 91.44,20.57 88.39,17.53 v86.61,17.53 | v83.57,17.53 83.04,17 J2.4 77.62,17 | 77.62,17 77.38,16.76 77.38,17.11 v76.2,18.29 | 77.62,17 77.62,17.04 77.38,17.27 | v76.2,19.81 76.45,20.07 R10.2 | v76.2,21.84 76.45,22.1 R33.2 | SW_LOG.1 84.58,28.96 v82.3,28.96 | v77.72,29.72 77.72,33.11 R2.2
  Top 0.508: R9.2 77.38,17.27 77.38,16.76 R8.2 C31.2 R6.1 R7.2
  Top 0.813: C5.1 69.37,74.99 U$2.OUT
  Bottom 0.406: v76.45,72.64 v77.98,72.64 | v82.55,59.69 91.95,59.69 93.22,60.96 97.69,60.96 98.7,59.94 98.7,58.32 | v97.54,57.15 98.7,58.32 | 98.7,58.32 98.7,34.19 97.28,32.77 92.46,32.77 | 92.46,32.77 87.88,32.77 86.36,31.24 SW_LOG.1 | 92.46,32.77 91.44,31.75 v91.44,31.5 | v86.61,17.53 v83.57,17.53 | v76.2,18.29 v76.2,19.81 v76.2,21.84 | v82.3,28.96 78.49,28.96 v77.72,29.72
+5V  (via drill 0.35)
  Top 0.813: 51.82,61.47 OSC2.+ 50.71,62.57 C7.1 50.01,67.25 NJM7805S.OUT 49.41,68.82 U$3.A | 51.82,61.47 53.85,59.44 64.01,59.44 | 64.01,59.44 64.52,59.44 68.67,63.59 C4.1 69.37,66.99 U$2.IN 70.73,68.82 U$1.K | 64.01,59.44 67.91,55.53 C29.2 IC5.16 IC5.15 | v63.5,36.32 65.02,36.32 65.28,36.07 65.28,26.16 65.53,25.91 66.8,25.91 67.4,25.31 C30.2 67.91,24.12 IC3.16 IC3.15 | 51.82,61.47 51.82,59.94 | 51.82,59.94 51.31,59.44 | 51.31,59.44 49.53,59.44 47.5,61.47 38.35,61.47 37.85,60.96 | 37.85,60.96 LOADSELL.1 37.25,57.91 C16.2 | 37.85,60.96 34.29,57.4 30.99,57.4 v29.97,56.39 | v28.45,54.86 26.16,52.58 25.4,52.58 | 25.4,52.58 C9.2 24.26,52.54 IC4.5 24.26,51.44 25.4,52.58 | v26.42,29.46 25.4,28.45 | 25.4,28.45 C26.2 24.26,28.41 24.26,27.31 | 25.4,28.45 24.26,27.31 | 24.26,27.31 IC10.5 | v26.16,42.16 25.91,41.91 25.15,41.91 | 25.15,41.91 C18.2 23.96,39.85 IC7.5 24.01,40.77 25.15,41.91 | 51.31,59.44 50.13,58.25 C10.2 50.13,55.09 IC9.5 | 51.82,59.94 v51.82,58.17 | v51.82,47.24 50.55,45.97 C12.2 50.42,45.93 IC6.5 | v51.82,36.07 50.8,35.05 C21.2 50.63,33 IC8.5 | v51.82,24.13 51.82,23.62 | 51.82,23.62 51.82,22.77 R11.1 | R13.1 50.55,14.48 v49.53,15.49 47.5,13.46 42.67,13.46 42.16,12.95 42.16,11.94 42.67,11.43 R14.1 | v49.53,8.13 50.55,7.11 R15.1 | 51.82,23.62 51.31,23.11 C28.2 50.13,22.44 v49.53,21.84 49.02,21.34 43.43,21.34 42.67,20.57 42.67,19.98 R12.1
  Bottom 0.813: IC5.15 62.48,42.32 62.48,37.34 v63.5,36.32 | v29.97,56.39 v28.45,54.86 28.45,44.45 | v26.42,29.46 28.45,31.5 28.45,44.45 | 28.45,44.45 v26.16,42.16 | v51.82,58.17 v51.82,47.24 v51.82,36.07 v51.82,24.13 | v49.53,21.84 v49.53,15.49 v49.53,8.13
GND  (via drill 0.35)
  other vias: 80.77,14.22 78.49,71.37 78.49,67.56 80.52,50.29 74.17,54.86 86.61,42.42 87.63,40.64 92.46,40.64 92.46,52.58 97.54,52.58 97.54,40.64 92.46,46.99 97.54,46.99 80.52,44.2 74.93,48.51 74.42,43.94 76.71,48.51 76.71,44.96 74.68,51.31 71.63,48.26 71.63,43.94 72.64,46.23 72.64,37.85 74.68,37.85 74.68,39.88 74.68,41.91 74.68,35.81 74.68,31.75 72.64,31.75 72.64,35.81 71.88,41.91 70.1,37.85 69.09,41.4 69.34,43.94 69.6,49.02 73.41,53.09 71.37,56.13 69.09,55.12 67.56,57.91 66.04,59.18 68.33,61.72 69.85,63.25 70.1,66.04 71.63,68.07 71.63,64.52 71.37,59.94 83.82,70.61 83.82,67.56 85.85,65.28 87.38,63.75 90.42,62.48 92.46,61.72 92.2,58.67 92.46,56.64 93.73,62.99 97.28,59.18 97.79,55.88 91.19,72.14 91.19,77.98 98.04,77.98 98.04,72.9 85.6,73.66 85.6,77.72 80.77,77.72 76.96,74.93 74.68,77.47 70.36,77.72 73.15,74.93 82.04,70.1 82.04,66.55 84.33,64.26 81.53,64.52 76.2,71.37 76.2,66.55 81.79,60.96 78.74,64.26 81.79,62.74 74.17,71.63 74.17,66.55 75.95,63.75 79.5,60.45 82.04,58.67 75.95,57.4 78.74,56.64 82.04,56.64 77.72,58.93 85.09,55.88 89.15,58.67 86.36,58.67 87.88,55.63 89.15,60.96 92.46,68.58 89.66,68.58 77.98,37.08 76.71,34.54 76.71,31.75 76.71,29.97 76.71,28.45 78.23,26.92 80.52,24.38 83.57,21.08 83.57,18.8 80.77,21.59 77.98,24.38 74.68,27.94 74.68,22.1 74.68,24.89 76.45,24.89 75.95,23.37 72.64,29.72 72.64,26.42 72.64,22.86 72.9,20.57 74.93,20.07 74.93,18.03 70.87,22.86 70.87,28.96 70.87,26.42 70.87,19.81 72.64,18.03 70.87,16.26 70.87,12.45 70.87,8.89 69.34,7.11 69.6,2.03 73.91,2.03 78.49,2.03 78.49,6.1 74.17,6.1 74.17,10.16 74.17,14.99 81.03,8.89 84.33,11.68 81.53,10.41 84.33,9.4 84.33,6.86 83.57,4.83 83.57,2.03 90.17,2.03 89.41,6.6 86.36,6.86 86.36,9.4 97.79,2.03 98.04,8.38 91.95,8.38 91.44,4.83 97.28,34.8 93.73,34.04 88.9,34.29 86.36,32.77 86.36,35.05 91.19,35.05 92.96,31.75 90.42,30.48 87.88,29.21 84.33,27.94 82.3,27.69 84.07,35.31 84.33,32.26 84.58,30.23 82.3,32 80.01,31.75 80.01,29.97 80.01,27.94 85.09,21.84 85.09,18.54 85.09,14.99 85.09,16.76 86.61,19.56 86.61,22.1 88.14,18.8 90.42,21.08 90.42,26.16 87.38,23.88 92.46,25.15 92.46,21.08 90.93,18.8 88.14,16.51 97.54,26.92 97.54,20.32 97.54,14.48 92.96,14.22 94.49,17.78 89.41,13.97 89.92,10.67 86.87,15.24 86.11,13.21 88.65,38.35 90.68,38.35 81.28,38.86 81.28,40.89 80.52,47.75 77.98,52.58 76.71,51.05 69.6,71.12 67.06,73.41 67.31,68.33 64.77,66.55 59.94,66.55 54.1,66.8 55.12,60.71 59.94,60.71 64.01,60.71 67.31,64.01 64.01,76.96 56.13,77.22 50.04,71.37 52.58,73.15 52.32,68.58 48.77,75.18 43.18,75.44 37.34,74.93 35.31,77.22 41.91,77.47 48.26,77.72 45.21,69.34 47.5,67.56 49.53,65.53 50.04,60.96 46.48,62.48 38.61,62.48 41.15,66.55 37.85,66.55 36.32,69.09 34.8,70.36 33.53,74.68 27.18,74.68 20.32,74.93 15.24,74.93 12.95,73.15 10.67,71.12 7.87,68.33 5.59,66.29 3.81,64.77 3.81,61.21 1.78,66.55 5.08,69.85 9.4,74.17 12.7,77.72 18.03,77.98 23.62,77.98 29.97,77.98 2.29,77.72 8.13,77.72 2.03,72.39 3.81,56.39 1.52,56.39 1.52,48.26 3.56,48.26 3.56,43.94 1.52,43.94 3.56,37.85 1.52,37.85 1.52,27.69 3.56,27.69 5.33,23.62 5.33,21.34 2.79,14.73 2.29,2.29 9.14,2.03 8.89,8.89 2.54,8.64 16,2.29 16,8.89 21.84,8.89 22.1,2.29 28.7,2.29 28.45,8.64 35.05,8.64 35.05,2.03 41.15,2.03 40.89,8.38 46.23,2.03 49.78,5.84 56.13,5.84 56.13,1.78 63.75,9.4 63.75,1.78 65.28,13.21 63.5,18.29 63.5,24.89 63.5,30.48 63.25,35.05 65.28,23.11 65.28,16 67.06,30.99 67.31,26.92 70.36,35.05 68.83,28.96 69.09,24.89 69.09,13.21 66.29,7.87 65.28,19.81 66.55,44.45 63.75,39.88 66.55,42.67 66.04,39.62 63.5,58.17 66.55,54.61 66.55,51.31 66.55,48.01 63.25,44.7 53.09,58.42 53.09,54.1 47.75,59.18 42.67,60.2 39.12,60.2 33.02,56.13 33.02,58.67 35.31,60.45 29.21,57.66 25.15,58.93 20.57,58.93 17.78,59.18 14.99,61.98 11.94,61.98 11.94,67.82 14.99,67.82 17.78,69.85 20.32,69.85 23.62,69.6 26.67,69.85 29.46,69.6 32.26,69.6 34.54,66.55 31.75,63.75 28.7,66.8 25.91,63.25 23.11,67.06 19.81,63.5 17.53,67.31 29.21,61.21 8.89,58.42 7.87,63.25 9.91,66.04 5.84,55.37 3.81,53.34 6.1,52.07 9.65,55.63 13.46,59.18 15.75,56.64 19.05,56.39 23.11,56.39 26.92,56.13 25.4,54.1 25.91,51.31 27.18,49.28 29.72,51.82 32.26,49.02 32.26,52.58 31.5,55.12 35.56,54.1 34.8,49.28 34.8,47.24 32,45.97 38.61,47.24 41.15,49.28 43.18,47.24 48.51,49.28 50.8,49.28 50.04,47.5 53.09,47.24 53.09,49.28 56.64,46.23 56.64,44.45 59.44,43.94 57.15,50.8 58.17,52.32 49.02,54.1 55.88,43.43 55.88,41.91 54.36,41.15 53.09,42.16 59.44,41.4 50.55,38.35 54.36,38.1 54.36,36.07 57.15,37.85 58.93,38.86 56.39,39.62 58.42,36.32 57.4,32.77 56.13,34.04 53.59,31.75 54.86,30.23 50.55,26.16 53.09,26.16 56.39,26.92 57.66,25.65 60.2,28.19 58.93,29.46 61.47,33.78 61.47,30.23 61.47,24.89 61.47,20.57 62.23,13.46 44.96,26.16 44.96,24.13 38.61,24.13 38.61,26.16 32.51,26.16 32.51,24.13 29.72,23.11 28.45,24.38 29.72,30.99 46.48,36.07 46.48,38.1 38.35,38.1 38.35,36.07 32,34.8 32,36.58 27.18,37.34 27.18,32 26.42,26.67 24.13,30.23 20.57,28.7 14.48,28.7 14.48,25.91 9.14,36.83 9.14,34.29 6.6,30.99 4.32,35.05 6.35,39.62 6.1,44.96 17.53,45.72 17.53,33.53 27.43,41.15 32,41.91 29.72,36.58 29.72,45.72 29.72,48.01 29.72,41.15 9.4,16 16.51,16.26 18.29,20.83 42.67,40.89 42.93,29.46 57.91,56.13 59.94,58.17 55.12,58.17 62.74,53.09 23.62,15.75 29.97,15.75 36.32,16 33.53,20.07 38.35,20.07 13.72,54.36 18.29,54.1
  pour Top: 0.25,79.76 0.25,0.25 99.82,0.25 99.82,79.76
  pour Bottom: 0.25,79.76 0.25,0.25 99.82,0.25 99.82,79.76
IO0  (via drill 0.35)
  Top 0.254: R2.1 80.19,33.87 IC1.25 80.19,38.79 80.52,39.12 80.52,41.4 v80.26,41.66 | v76.96,42.16 v76.96,43.69 | v78.49,74.19 IC2.2
  Bottom 0.254: v80.26,41.66 80.01,41.91 77.22,41.91 v76.96,42.16 | v76.96,43.69 77.72,44.45 77.72,51.56 75.18,54.1 73.15,54.1 72.39,54.86 72.39,73.15 73.43,74.19 v78.49,74.19
IO2  (via drill 0.35)
  Top 0.254: 79.08,11.6 R6.2 79.32,11.67
  Top 0.305: IC1.24 78.94,34.21 78.95,34.2 78.95,28.49 | 78.99,28.45 78.95,28.49 | 78.95,28.49 78.95,27.48 84.33,22.1 84.33,15.24 | 84.07,14.99 82.79,13.7 J2.7 81.77,13.7 79.5,11.43 R6.2 | 84.07,14.99 84.33,15.24 | 84.33,15.24 84.33,14.73 | 84.33,14.73 v84.33,13.97 | 84.07,14.99 84.33,14.73
  Bottom 0.305: v84.33,13.97 85.34,12.95 JP1.1
IO4
  Top 0.305: IC1.26 81.46,26.74 85.85,22.35 85.85,14.22 84.23,12.6 J2.8 81.69,12.6 80.52,11.43 80.52,10.67 79.25,9.4 R7.1
IO12
  Top 0.305: IC1.14 77.84,54.22 75.69,52.07 75.69,28.19 79.08,24.8 R33.1 80.88,20.3 J2.1
IO13  (via drill 0.35)
  Top 0.305: J2.2 79.95,19.2 R10.1 79.08,20.74 78.74,21.08 74.42,21.08 73.66,21.84 73.66,48.51 v74.93,49.78 | IC1.16 76.58,49.91 v76.45,49.78
  Bottom 0.305: v76.45,49.78 v74.93,49.78
IO14  (via drill 0.35)
  Top 0.305: R8.1 80.52,15.49 80.92,15.9 J2.5 83.47,15.9 v83.57,16 | IC1.13 81.46,51.89 v81.53,51.82
  Bottom 0.305: v81.53,51.82 81.53,41.66 82.8,40.39 82.8,33.02 83.31,32.51 83.31,26.67 83.44,26.54 87.38,22.61 87.38,17.02 86.36,16 v83.57,16
IO15  (via drill 0.35)
  Top 0.254: 82.18,18.03 J2.3
  Top 0.305: 82.18,18.03 R9.1 79.08,18.71 78.74,19.05 72.9,19.05 71.63,20.32 71.63,39.62 v72.9,40.89 | IC1.23 77.23,41.02 v77.11,40.89
  Bottom 0.305: v77.11,40.89 v72.9,40.89
LOADCELL
  Top 0.305: IC5.1 58.93,50.29 56.81,52.41 C15.2 53.85,52.41 R20.1
MCPCS1  (via drill 0.35)
  Top 0.305: IC1.8 87.81,52.76 v87.63,52.58 | v83.82,38.1 v81.79,38.1
  Bottom 0.305: v87.63,52.58 87.63,41.91 v83.82,38.1 | v81.79,38.1 77.72,38.1 76.45,36.83 70.61,36.83 68.83,35.05 IC5.10
MCPCS2  (via drill 0.35)
  Top 0.305: IC3.10 70.1,9.05 70.1,29.89 v70.94,30.73 | v82.15,30.73 84.07,30.73 85.34,32 v85.34,35.31 | v85.34,38.61 84.58,39.37 84.58,40.13 83.06,41.66 v83.06,42.24 | v83.06,43.69 82.73,44.02 IC1.12
  Bottom 0.305: v70.94,30.73 v82.15,30.73 | v85.34,35.31 v85.34,38.61 | v83.06,42.24 v83.06,43.69
MISO  (via drill 0.35)
  Top 0.305: IC1.10 85.27,44.12 v85.09,43.94 | v83.82,39.88 v81.79,39.88 | IC5.12 65.12,37.34 63.5,37.34 62.48,36.32 62.48,14.73 65.28,11.94 IC3.12
  Bottom 0.305: v85.09,43.94 85.09,41.15 v83.82,39.88 | v81.79,39.88 77.47,39.88 76.45,38.86 70.61,38.86 69.34,40.13 IC5.12
MOSI
  Top 0.305: IC1.11 84,55.45 83.82,55.63 77.47,55.63 70.61,48.77 70.61,40.13 68.07,37.59 IC5.11
  Bottom 0.305: IC5.11 66.29,35.97 66.29,10.92 67.82,9.4 IC3.11
N$1
  Top 0.305: 22.64,48.48 22.86,48.26 | 22.86,48.26 23.03,48.09 | 23.03,48.09 R5.2 | 23.03,48.09 23.19,48.26 | 23.41,48.48 23.51,48.58 | IC4.4 23.51,48.58 | 23.41,48.48 22.64,48.48 | 22.64,48.48 22.61,48.51 21.53,48.51 IC4.3 23.51,48.58 | 22.86,48.26 23.19,48.26 | 23.19,48.26 23.41,48.48
N$2
  Top 0.406: J1.1 94.71,68.1 92.71,70.1 90.17,70.1 89.7,69.64 IC2.20
N$3
  Top 0.254: J1.2 90.73,67.45 | C2.1 89.75,67.4 89.39,67.04 IC2.16
  Top 0.406: 90.73,67.45 C2.1
N$4
  Top 0.254: J1.3 93.13,66.8 C1.1 92.54,66.55 90.08,66.55 89.92,66.39 IC2.15
N$5
  Top 0.305: IC4.1 20.54,51.4 R3.1 19.22,51.31 R4.2
N$6
  Top 0.305: IC6.1 46.71,45.05 R21.1 43.86,45.05 R22.2
N$7
  Top 0.305: R4.1 PRS_1_1.3
N$8
  Top 0.305: R22.1 PRS_1_2.3
N$9
  Top 0.305: IC6.3 48.77,42.23 48.85,42.23 | 48.85,42.23 49.53,42.23 | 49.53,42.23 IC6.4 | R23.2 49.19,41.89 | 49.19,41.89 49.53,42.23 | 49.19,41.89 48.85,42.23
N$10
  Top 0.305: R25.2 17.45,40.73 R24.1 20.29,40.73 IC7.1
N$11
  Top 0.305: PRS_1_3.3 R25.1
N$12
  Top 0.305: IC7.3 22.29,37.91 | R26.2 22.77,37.43 | 22.77,37.43 22.73,37.47 | 22.73,37.47 22.48,37.72 | 22.48,37.72 22.29,37.91 | 22.77,37.43 23.26,37.91 | 23.26,37.91 IC7.4 | 22.29,37.91 22.86,37.91 | 22.86,37.91 23.26,37.91 | 22.86,37.91 22.86,37.85 | 22.86,37.85 22.86,37.59 22.73,37.47 | 22.48,37.72 22.73,37.72 22.86,37.85
N$13
  Top 0.305: R28.2 44.12,34.12 R27.1 46.71,34.12 IC8.1
N$14
  Top 0.305: PRS_1_4.3 R28.1
N$15
  Top 0.305: IC8.3 48.77,31.05 48.85,31.05 | 48.85,31.05 49.53,31.05 | 49.53,31.05 IC8.4 | R29.2 49.19,30.71 | 49.19,30.71 49.53,31.05 | 49.19,30.71 48.85,31.05
N$16
  Top 0.305: R20.2 50.89,52.58 | 50.89,52.58 50.74,52.58 IC9.4 50.59,52.73 50.59,52.28 | R19.1 50.59,52.28 | 50.59,52.28 50.89,52.58
N$17
  Top 0.813: VAT1.2 VAT2.1
N$18
  Top 0.305: IC10.1 20.54,27.27 R30.1 19.22,27.18 R31.2
N$19
  Top 0.305: R31.1 PRS_2.3
N$20
  Top 0.305: IC10.3 22.35,24.45 | 22.35,24.45 22.61,24.45 | 22.61,24.45 23.11,24.45 | 23.11,24.45 IC10.4 | R32.2 22.77,24.03 | 22.77,24.03 22.35,24.45 | 22.77,24.03 22.77,24.11 | 22.77,24.11 23.11,24.45 | 22.61,24.45 22.61,24.27 22.77,24.11
N$21
  Top 0.813: SW_POW.2 VAT1.1
N$22
  Top 0.305: LOADSELL.2 38.1,55.63 R16.1
N$23
  Top 0.406: LED_POW.1 94.58,30.65 R34.1
N$24
  Top 0.305: R19.2 47.37,51.35 IC9.3 44.1,53.15 R18.1
N$25
  Top 0.305: LOADSELL.3 38.1,52.58 R18.2
N$26
  Top 0.406: R35.1 LED_LOG.1
N$27
  Top 0.406: LED_ERR.1 83.48,61.38 R36.1
N$28
  Top 0.305: IC9.1 46.21,55.05 R17.1 43.61,55.54 R16.2
N$29  (via drill 0.35)
  Top 0.406: IC1.30 86.54,40.46 85.85,41.15 85.85,41.66 85.6,41.91 84.33,41.91 v84.07,42.16 | v76.2,55.63 75.53,56.3 R35.2
  Bottom 0.406: v84.07,42.16 84.07,52.07 83.31,52.83 78.99,52.83 v76.2,55.63
N$30  (via drill 0.35)
  Top 0.406: R36.2 86.19,56.64 v88.39,56.64 | v88.9,40.13 87.81,39.04 IC1.31
  Bottom 0.406: v88.39,56.64 88.9,56.13 v88.9,40.13
N$31
  Top 0.406: R37.1 88.86,27.56 SW_LOG.2 90.35,32.22 IC1.33
PRESSURE_1_1
  Top 0.305: IC5.3 56.39,45.21 53.34,48.26 34.54,48.26 33.11,46.82 C14.2 25.07,46.82 R5.1
PRESSURE_1_2
  Top 0.305: IC5.4 54.78,42.67 C13.2 51.23,40.47 R23.1
PRESSURE_1_3
  Top 0.305: R26.1 26,35.81 C19.2 33.36,35.65 34.8,37.08 55.12,37.08 58.17,40.13 IC5.5
PRESSURE_1_4
  Top 0.305: R29.1 51.23,29.3 C22.2 57.15,33.87 57.15,36.32 58.42,37.59 IC5.6
PRESSURE_2
  Top 0.305: IC5.8 60.1,29.37 55.88,25.15 30.48,25.15 28.03,22.69 C27.2 24.81,22.69 R32.1
RTS  (via drill 0.35)
  Top 0.254: IC2.3 77.86,73.54 77.22,72.9 77.22,67.31 81.03,63.5 v85.6,63.5 | v87.71,65.36 88.82,65.36 89.92,64.26 90.93,64.26 93.64,61.56 C3.1
  Top 0.406: C3.1 R1.1 93.64,56.22 94.16,55.7 IC1.3
  Bottom 0.254: v85.6,63.5 87.46,65.36 v87.71,65.36
SCK  (via drill 0.35)
  Top 0.305: IC1.9 86.54,43.61 85.85,42.93 v80.52,42.93 | v65.53,14.48 IC3.13
  Bottom 0.305: v80.52,42.93 68.17,42.93 IC5.13 64.26,39.02 64.26,15.49 65.28,14.48 v65.53,14.48
SERIAL_M2S  (via drill 0.35)
  Top 0.254: IC2.5 83.97,72.24 84.58,71.63 84.58,67.56 88.65,63.5 90.42,63.5 91.44,62.48 v91.44,55.88 | v91.44,40.13 92.89,38.68 IC1.35
  Bottom 0.254: v91.44,55.88 v91.44,40.13
SERIAL_S2M  (via drill 0.35)
  Top 0.254: IC1.34 91.62,38.68 v90.17,40.13 | v90.17,55.88 90.17,61.72 89.66,62.23 87.88,62.23 82.8,67.31 v82.8,71.58 | v82.8,73.63 81.6,74.84 IC2.1
  Bottom 0.254: v90.17,40.13 v90.17,55.88 | v82.8,71.58 v82.8,73.63
THERMO_H_1
  Top 0.305: IC3.1 R11.2 54.19,20.99 54.61,20.57 TH_H2.1
THERMO_H_2
  Top 0.305: IC3.2 58.42,19.56 55.37,16.51 50.8,16.51 48.26,19.05 R12.2 45.3,17.44 45.72,17.02 TH_H1.1
THERMO_L_1
  Top 0.305: IC3.3 59.18,17.02 56.64,14.48 R13.2 53.94,12.87 54.36,12.45 TH_L3.1
THERMO_L_2
  Top 0.305: TH_L2.1 45.47,9.65 45.05,10.07 R14.2 48.01,11.43 50.29,9.14 55.63,9.14 57.15,10.67 57.15,13.21 58.42,14.48 IC3.4
THERMO_L_3
  Top 0.305: TH_L1.1 54.36,5.08 53.94,5.5 R15.2 56.39,7.11 58.42,9.14 58.42,10.26 IC3.5
V+  (via drill 0.35)
  Top 0.813: C6.1 50.01,74.99 NJM7805S.IN 47.61,73.42 | 13.46,61.21 4.83,52.58 4.83,47.24 | 4.83,47.24 5.42,46.65 C8.2 7.79,46.23 PRS_1_1.1 | 4.83,47.24 4.83,36.83 5.68,35.98 C17.2 7.53,35.56 PRS_1_3.1 | 13.46,61.21 17.02,57.66 27.18,57.66 30.99,53.85 v30.99,47.75 | v31.5,29.46 31.84,29.12 C20.2 34.46,28.96 PRS_1_4.1 | v32.26,40.39 32.35,40.3 C11.2 33.95,39.88 PRS_1_2.1 | 13.46,61.21 OSC1.+ SW_POW.1 13.46,71.63 15.12,73.28 U$4.K 37.63,73.24 C23.1 43.01,73.24 PS1.1 43.19,73.42 47.61,73.42 | 47.61,73.42 U$3.K
  Bottom 0.813: v30.99,47.75 30.99,41.15 | 30.99,41.15 30.99,29.97 v31.5,29.46 | 30.99,41.15 31.75,40.39 v32.26,40.39

### Text on the board
tNames: + | + | + | + | + | 5V | dp | dm | s | GND | GND | 18v | s | GND | s | 18v | GND | 18v | s | GND | 18v | s | + | + | GND | 12v | GND | GND | GND | GND | 1kHz BurningTest DataLogger | v1.0.0 221022 | FLASHING | GND